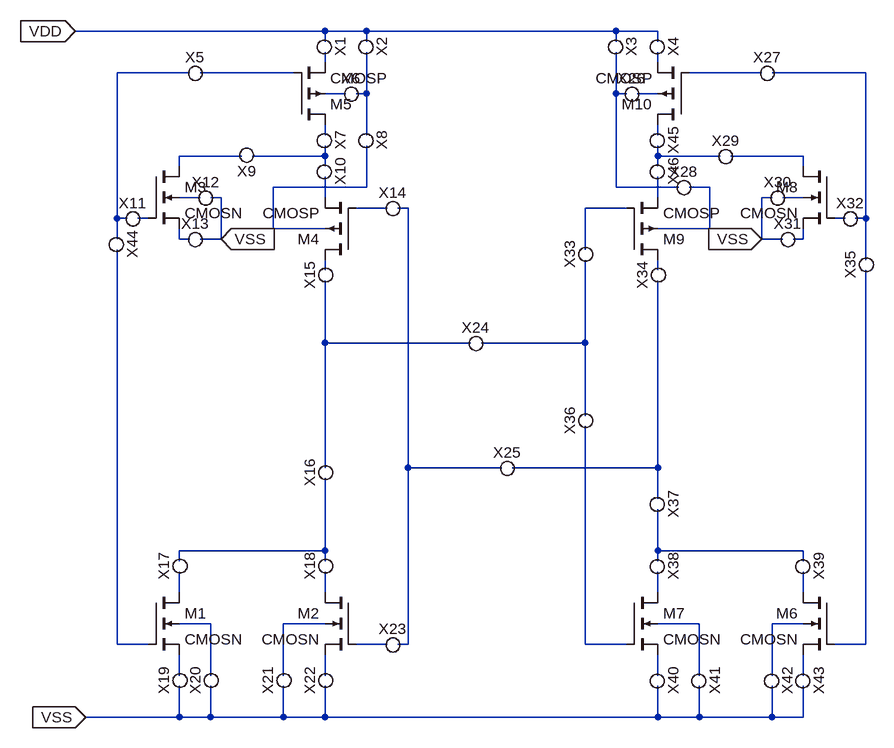
[diagram p0: schematic module2.asc]
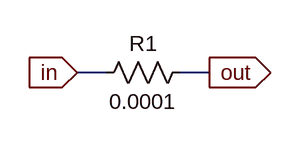
[diagram p1: sub-circuit para_register.asc]
module2.asc, the LTspice schematic file:
Version 4
SHEET 1 2192 1252
WIRE 128 32 -256 32
WIRE 192 32 128 32
WIRE 576 32 192 32
WIRE 640 32 576 32
WIRE 128 48 128 32
WIRE 192 48 192 32
WIRE 576 48 576 32
WIRE 640 48 640 32
WIRE 128 80 128 64
WIRE 640 80 640 64
WIRE -80 96 -192 96
WIRE 80 96 -64 96
WIRE 800 96 688 96
WIRE 960 96 816 96
WIRE 160 128 128 128
WIRE 192 128 192 64
WIRE 192 128 176 128
WIRE 576 128 576 64
WIRE 592 128 576 128
WIRE 640 128 608 128
WIRE 128 192 128 176
WIRE 192 192 192 128
WIRE 640 192 640 176
WIRE 0 224 -96 224
WIRE 128 224 128 208
WIRE 128 224 16 224
WIRE 640 224 640 208
WIRE 736 224 640 224
WIRE 864 224 752 224
WIRE -96 240 -96 224
WIRE 128 240 128 224
WIRE 640 240 640 224
WIRE 864 240 864 224
WIRE 192 272 192 208
WIRE 192 272 48 272
WIRE 576 272 576 128
WIRE 672 272 576 272
WIRE 720 272 688 272
WIRE -64 288 -96 288
WIRE -32 288 -48 288
WIRE 128 288 128 256
WIRE 640 288 640 256
WIRE 816 288 800 288
WIRE 864 288 832 288
WIRE 224 304 176 304
WIRE 256 304 240 304
WIRE 592 304 528 304
WIRE -192 320 -192 96
WIRE -176 320 -192 320
WIRE -144 320 -160 320
WIRE 928 320 912 320
WIRE 960 320 960 96
WIRE 960 320 944 320
WIRE 48 336 48 272
WIRE 128 336 48 336
WIRE 720 336 720 272
WIRE 720 336 640 336
WIRE -192 352 -192 320
WIRE -96 352 -96 336
WIRE -80 352 -96 352
WIRE -32 352 -32 288
WIRE -32 352 -64 352
WIRE 800 352 800 288
WIRE 832 352 800 352
WIRE 864 352 864 336
WIRE 864 352 848 352
WIRE 528 368 528 304
WIRE 960 384 960 320
WIRE 128 400 128 384
WIRE 640 400 640 384
WIRE 128 512 128 416
WIRE 352 512 128 512
WIRE 528 512 528 384
WIRE 528 512 368 512
WIRE 528 624 528 512
WIRE 128 704 128 512
WIRE 256 704 256 304
WIRE 400 704 256 704
WIRE 640 704 640 416
WIRE 640 704 416 704
WIRE 640 752 640 704
WIRE 128 832 128 720
WIRE 128 832 -96 832
WIRE 640 832 640 768
WIRE 864 832 640 832
WIRE -96 848 -96 832
WIRE 128 848 128 832
WIRE 640 848 640 832
WIRE 864 848 864 832
WIRE -96 896 -96 864
WIRE 128 896 128 864
WIRE 640 896 640 864
WIRE 864 896 864 864
WIRE -48 944 -96 944
WIRE 128 944 64 944
WIRE 704 944 640 944
WIRE 864 944 816 944
WIRE -192 976 -192 368
WIRE -144 976 -192 976
WIRE 224 976 176 976
WIRE 256 976 256 704
WIRE 256 976 240 976
WIRE 528 976 528 640
WIRE 592 976 528 976
WIRE 960 976 960 400
WIRE 960 976 912 976
WIRE -96 1024 -96 992
WIRE -48 1024 -48 944
WIRE 64 1024 64 944
WIRE 128 1024 128 992
WIRE 640 1024 640 992
WIRE 704 1024 704 944
WIRE 816 1024 816 944
WIRE 864 1024 864 992
WIRE -96 1088 -96 1040
WIRE -96 1088 -240 1088
WIRE -48 1088 -48 1040
WIRE -48 1088 -96 1088
WIRE 64 1088 64 1040
WIRE 64 1088 -48 1088
WIRE 128 1088 128 1040
WIRE 128 1088 64 1088
WIRE 640 1088 640 1040
WIRE 640 1088 128 1088
WIRE 704 1088 704 1040
WIRE 704 1088 640 1088
WIRE 816 1088 816 1040
WIRE 816 1088 704 1088
WIRE 864 1088 864 1040
WIRE 864 1088 816 1088
FLAG -32 352 VSS
IOPIN -32 352 In
FLAG 800 352 VSS
IOPIN 800 352 In
FLAG -256 32 VDD
IOPIN -256 32 In
FLAG -240 1088 VSS
IOPIN -240 1088 In
SYMBOL nmos4 -144 896 R0
SYMATTR InstName M1
SYMATTR Value CMOSN
SYMATTR Value2 l={L6} w={W6} m={M6}
SYMBOL nmos4 176 896 M0
SYMATTR InstName M2
SYMATTR Value CMOSN
SYMATTR Value2 l={L7} w={W7} m={M7}
SYMBOL nmos4 -144 240 R0
SYMATTR InstName M3
SYMATTR Value CMOSN
SYMATTR Value2 l={L8} w={W8} m={M8}
SYMBOL pmos4 176 384 R180
SYMATTR InstName M4
SYMATTR Value CMOSP
SYMATTR Value2 l={L9} w={W9} m={M9}
SYMBOL pmos4 80 176 M180
SYMATTR InstName M5
SYMATTR Value CMOSP
SYMATTR Value2 l={L10} w={W10} m={M10}
SYMBOL nmos4 912 896 M0
SYMATTR InstName M6
SYMATTR Value CMOSN
SYMATTR Value2 l={L11} w={W11} m={M11}
SYMBOL nmos4 592 896 R0
SYMATTR InstName M7
SYMATTR Value CMOSN
SYMATTR Value2 l={L12} w={W12} m={M12}
SYMBOL nmos4 912 240 M0
SYMATTR InstName M8
SYMATTR Value CMOSN
SYMATTR Value2 l={L13} w={W13} m={M13}
SYMBOL pmos4 592 384 M180
SYMATTR InstName M9
SYMATTR Value CMOSP
SYMATTR Value2 l={L14} w={W14} m={M14}
SYMBOL pmos4 688 176 R180
SYMATTR InstName M10
SYMATTR Value CMOSP
SYMATTR Value2 l={L15} w={W15} m={M15}
SYMBOL para_register 112 48 R90
SYMATTR InstName X1
SYMBOL para_register 176 48 R90
SYMATTR InstName X2
SYMBOL para_register 560 48 R90
SYMATTR InstName X3
SYMBOL para_register 624 48 R90
SYMATTR InstName X4
SYMBOL para_register -80 112 R0
SYMATTR InstName X5
SYMBOL para_register 160 144 R0
SYMATTR InstName X6
SYMBOL para_register 112 192 R90
SYMATTR InstName X7
SYMBOL para_register 176 192 R90
SYMATTR InstName X8
SYMBOL para_register 16 208 R180
SYMATTR InstName X9
SYMBOL para_register 112 240 R90
SYMATTR InstName X10
SYMBOL para_register -176 336 R0
SYMATTR InstName X11
SYMBOL para_register -64 304 R0
SYMATTR InstName X12
SYMBOL para_register -80 368 R0
SYMATTR InstName X13
SYMBOL para_register 224 320 R0
SYMATTR InstName X14
SYMBOL para_register 144 416 R270
SYMATTR InstName X15
SYMBOL para_register 144 720 R270
SYMATTR InstName X16
SYMBOL para_register -80 864 R270
SYMATTR InstName X17
SYMBOL para_register 144 864 R270
SYMATTR InstName X18
SYMBOL para_register -80 1040 R270
SYMATTR InstName X19
SYMBOL para_register -32 1040 R270
SYMATTR InstName X20
SYMBOL para_register 80 1040 R270
SYMATTR InstName X21
SYMBOL para_register 144 1040 R270
SYMATTR InstName X22
SYMBOL para_register 224 992 R0
SYMATTR InstName X23
SYMBOL para_register 352 528 R0
SYMATTR InstName X24
SYMBOL para_register 400 720 R0
SYMATTR InstName X25
SYMBOL para_register 592 144 R0
SYMATTR InstName X26
SYMBOL para_register 800 112 R0
SYMATTR InstName X27
SYMBOL para_register 672 288 R0
SYMATTR InstName X28
SYMBOL para_register 736 240 R0
SYMATTR InstName X29
SYMBOL para_register 816 304 R0
SYMATTR InstName X30
SYMBOL para_register 832 368 R0
SYMATTR InstName X31
SYMBOL para_register 928 336 R0
SYMATTR InstName X32
SYMBOL para_register 544 384 R270
SYMATTR InstName X33
SYMBOL para_register 656 416 R270
SYMATTR InstName X34
SYMBOL para_register 976 400 R270
SYMATTR InstName X35
SYMBOL para_register 544 640 R270
SYMATTR InstName X36
SYMBOL para_register 624 752 R90
SYMATTR InstName X37
SYMBOL para_register 624 848 R90
SYMATTR InstName X38
SYMBOL para_register 848 848 R90
SYMATTR InstName X39
SYMBOL para_register 624 1024 R90
SYMATTR InstName X40
SYMBOL para_register 688 1024 R90
SYMATTR InstName X41
SYMBOL para_register 800 1024 R90
SYMATTR InstName X42
SYMBOL para_register 848 1024 R90
SYMATTR InstName X43
SYMBOL para_register -208 352 R90
SYMATTR InstName X44
SYMBOL para_register 624 192 R90
SYMATTR InstName X45
SYMBOL para_register 624 240 R90
SYMATTR InstName X46

para_register.asc, the sub-circuit schematic file:
Version 4
SHEET 1 880 680
WIRE 160 -176 128 -176
WIRE 272 -176 240 -176
FLAG 128 -176 in
IOPIN 128 -176 In
FLAG 272 -176 out
IOPIN 272 -176 Out
SYMBOL res 256 -192 R90
WINDOW 0 0 56 VBottom 2
WINDOW 3 32 56 VTop 2
SYMATTR InstName R1
SYMATTR Value 0.0001

The netlist it stands for:
* module2.asc
M1 N037 N045 N049 N041 CMOSN l={L6} w={W6} m={M6}
M2 N038 N046 N050 N042 CMOSN l={L7} w={W7} m={M7}
M3 N013 N026 N028 N019 CMOSN l={L8} w={W8} m={M8}
M4 N030 N023 N020 N017 CMOSP l={L9} w={W9} m={M9}
M5 N011 N004 N001 N007 CMOSP l={L10} w={W10} m={M10}
M6 N040 N048 N052 N044 CMOSN l={L11} w={W11} m={M11}
M7 N039 N047 N051 N043 CMOSN l={L12} w={W12} m={M12}
M8 N016 N027 N029 N022 CMOSN l={L13} w={W13} m={M13}
M9 N031 N025 N021 N018 CMOSP l={L14} w={W14} m={M14}
M10 N012 N005 N002 N010 CMOSP l={L15} w={W15} m={M15}
XX1 VDD N001 para_register
XX2 VDD N008 para_register
XX3 VDD N009 para_register
XX4 VDD N002 para_register
XX5 N003 N004 para_register
XX6 N007 N008 para_register
XX7 N011 N014 para_register
XX8 N008 N017 para_register
XX9 N014 N013 para_register
XX10 N014 N020 para_register
XX11 N003 N026 para_register
XX12 N019 VSS para_register
XX13 N028 VSS para_register
XX14 N023 N024 para_register
XX15 N032 N030 para_register
XX16 N035 N032 para_register
XX17 N037 N035 para_register
XX18 N038 N035 para_register
XX19 VSS N049 para_register
XX20 VSS N041 para_register
XX21 VSS N042 para_register
XX22 VSS N050 para_register
XX23 N046 N024 para_register
XX24 N032 N033 para_register
XX25 N024 N034 para_register
XX26 N009 N010 para_register
XX27 N005 N006 para_register
XX28 N009 N018 para_register
XX29 N015 N016 para_register
XX30 VSS N022 para_register
XX31 VSS N029 para_register
XX32 N027 N006 para_register
XX33 N033 N025 para_register
XX34 N034 N031 para_register
XX35 N048 N006 para_register
XX36 N047 N033 para_register
XX37 N034 N036 para_register
XX38 N036 N039 para_register
XX39 N036 N040 para_register
XX40 N051 VSS para_register
XX41 N043 VSS para_register
XX42 N044 VSS para_register
XX43 N052 VSS para_register
XX44 N003 N045 para_register
XX45 N012 N015 para_register
XX46 N015 N021 para_register

* block symbol definitions
.subckt para_register in out
R1 out in 0.0001
.ends para_register

.model NMOS NMOS
.model PMOS PMOS
.lib standard.mos
.backanno
.end